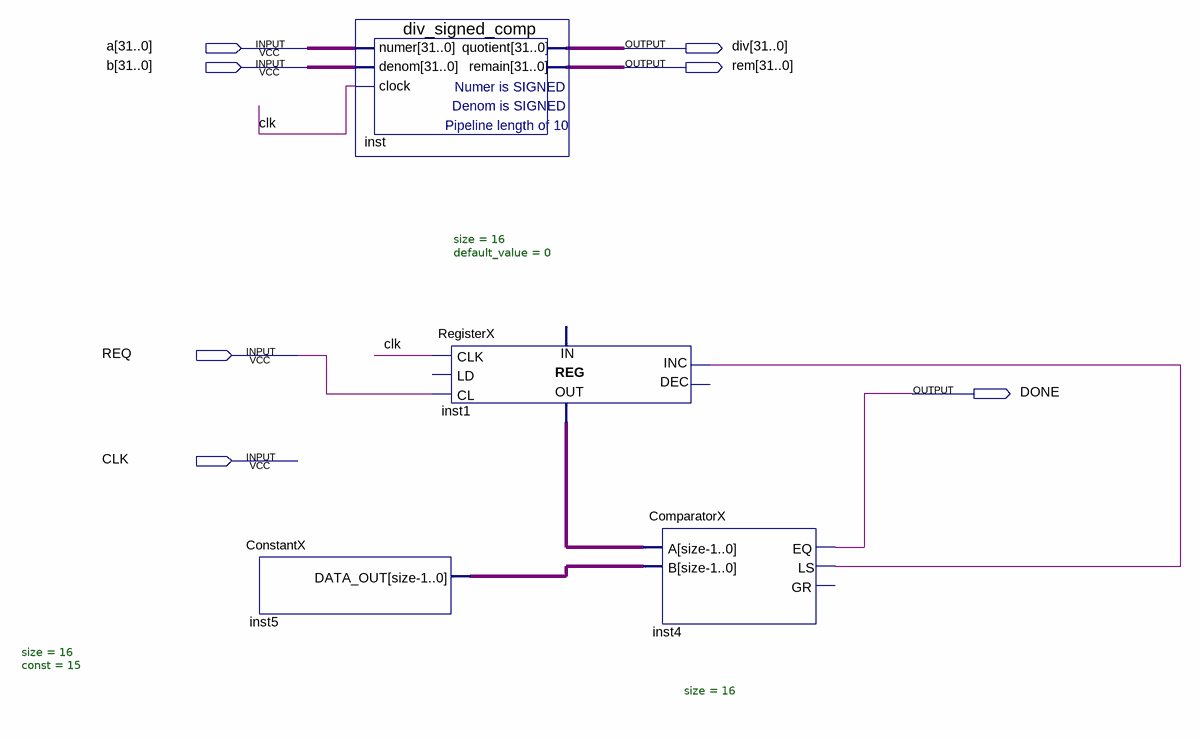
[diagram p0: schematic sheet]
// Quartus schematic div_rem.bdf as structural Verilog: 4 symbols, 7 pins
module div_rem (
  input  [31:0] a,
  input  [31:0] b,
  input  REQ,
  input  CLK,
  output [31:0] div,
  output [31:0] rem,
  output DONE
);

  wire inst4_ls;
  wire [15:0] inst1_data_out, inst5_data_out;

  ConstantX #(.size(16), .\const (15)) inst5 (.DATA_OUT(inst5_data_out));
  div_signed_comp inst (.numer(a), .denom(b), .clock(CLK), .quotient(div), .remain(rem));
  RegisterX #(.size(16), .default_value(0)) inst1 (
    .CLK(CLK), .CL(REQ), .INC(inst4_ls), .DATA_OUT(inst1_data_out));  // open: LD, DEC, DATA_IN
  ComparatorX #(.size(16)) inst4 (.A(inst1_data_out), .B(inst5_data_out), .EQ(DONE), .LS(inst4_ls));  // open: GR
endmodule
